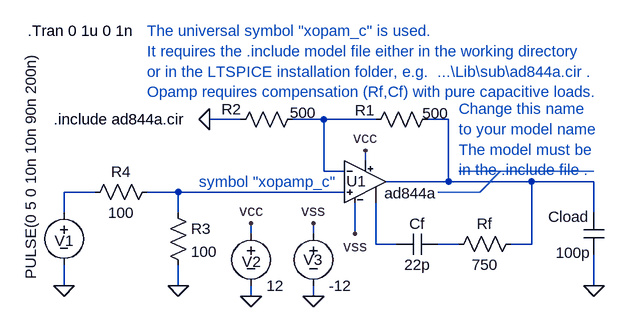
[diagram p0: schematic ad844_test2.asc]
ad844_test2.asc, the LTspice schematic file:
Version 4
SHEET 1 880 680
WIRE -48 64 -96 64
WIRE 80 64 32 64
WIRE 160 64 80 64
WIRE 272 64 240 64
WIRE 144 128 144 112
WIRE 80 144 80 64
WIRE 112 144 80 144
WIRE 272 160 272 64
WIRE 272 160 176 160
WIRE 400 160 272 160
WIRE 496 160 400 160
WIRE -272 176 -320 176
WIRE -144 176 -192 176
WIRE 112 176 -144 176
WIRE -320 208 -320 176
WIRE -144 208 -144 176
WIRE 496 208 496 160
WIRE -32 240 -32 224
WIRE 64 240 64 224
WIRE 128 240 128 192
WIRE 160 256 160 192
WIRE 192 256 160 256
WIRE 288 256 256 256
WIRE 400 256 400 160
WIRE 400 256 368 256
WIRE -320 320 -320 288
WIRE -144 320 -144 288
WIRE 496 320 496 272
WIRE -32 336 -32 320
WIRE 64 336 64 320
FLAG 144 112 vcc
FLAG 128 240 vss
FLAG -96 64 0
FLAG -144 320 0
FLAG -320 320 0
FLAG 64 336 0
FLAG -32 336 0
FLAG -32 224 vcc
FLAG 64 224 vss
FLAG 496 320 0
SYMBOL res 144 80 R270
WINDOW 0 14 -1 VTop 0
WINDOW 3 41 108 VBottom 0
SYMATTR InstName R1
SYMATTR Value 500
SYMBOL res -64 80 R270
WINDOW 0 16 2 VTop 0
WINDOW 3 42 112 VBottom 0
SYMATTR InstName R2
SYMATTR Value 500
SYMBOL res -160 192 R0
SYMATTR InstName R3
SYMATTR Value 100
SYMBOL res -288 192 R270
WINDOW 0 32 56 VTop 0
WINDOW 3 0 56 VBottom 0
SYMATTR InstName R4
SYMATTR Value 100
SYMBOL voltage -320 192 R0
WINDOW 3 -51 -233 VRight 0
WINDOW 123 0 0 Left 0
WINDOW 39 0 0 Left 0
WINDOW 0 -14 59 Left 0
SYMATTR Value PULSE(0 5 0 10n 10n 90n 200n)
SYMATTR InstName V1
SYMBOL cap 192 272 R270
WINDOW 0 32 32 VTop 0
WINDOW 3 0 32 VBottom 0
SYMATTR InstName Cf
SYMATTR Value 22p
SYMBOL res 272 272 R270
WINDOW 0 32 56 VTop 0
WINDOW 3 0 56 VBottom 0
SYMATTR InstName Rf
SYMATTR Value 750
SYMBOL voltage -32 224 R0
WINDOW 0 -14 59 Left 0
SYMATTR InstName V2
SYMATTR Value 12
SYMBOL voltage 64 224 R0
WINDOW 0 -15 56 Left 0
SYMATTR InstName V3
SYMATTR Value -12
SYMBOL cap 480 208 R0
WINDOW 0 -54 6 Left 0
WINDOW 3 -43 61 Left 0
SYMATTR InstName Cload
SYMATTR Value 100p
SYMBOL xopamp_c 144 96 R0
WINDOW 0 -29 63 Left 0
SYMATTR InstName U1
SYMATTR Value ad844a
TEXT -376 -72 Left 0 !.Tran 0 1u 0 1n
TEXT -192 -72 Left 0 ;The universal symbol "xopam_c" is used.\nIt requires the .include model file either in the working directory\nor in the LTSPICE installation folder, e.g.  ...\\Lib\\sub\\ad844a.cir .\nOpamp requires compensation (Rf,Cf) with pure capacitive loads.
TEXT -336 64 Left 0 !.include ad844a.cir
TEXT -112 160 Left 0 ;symbol "xopamp_c"
TEXT 288 48 Left 0 ;Change this name\nto your model name\nThe model must be\nin the .include file .
LINE Normal 320 176 256 176
LINE Normal 352 144 320 176
LINE Normal 288 144 352 144
LINE Normal 496 144 288 144

The netlist it stands for:
* ad844_test2.asc
R1 N001 N002 500
R2 0 N001 500
R3 N004 0 100
R4 N003 N004 100
V1 N003 0 PULSE(0 5 0 10n 10n 90n 200n)
Cf N005 N006 22p
Rf N006 N002 750
V2 vcc 0 12
V3 vss 0 -12
Cload N002 0 100p
XU1 N004 N001 vcc vss N002 N005 ad844a  ; pins In+ In- V+ V- OUT COMP
.Tran 0 1u 0 1n
* The universal symbol "xopam_c" is used.
* It requires the .include model file either in the working directory
* or in the LTSPICE installation folder, e.g.  ...\Lib\sub\ad844a.cir .
* Opamp requires compensation (Rf,Cf) with pure capacitive loads.
.include ad844a.cir
* symbol "xopamp_c"
* Change this name
* to your model name
* The model must be
* in the .include file .
.backanno
.end